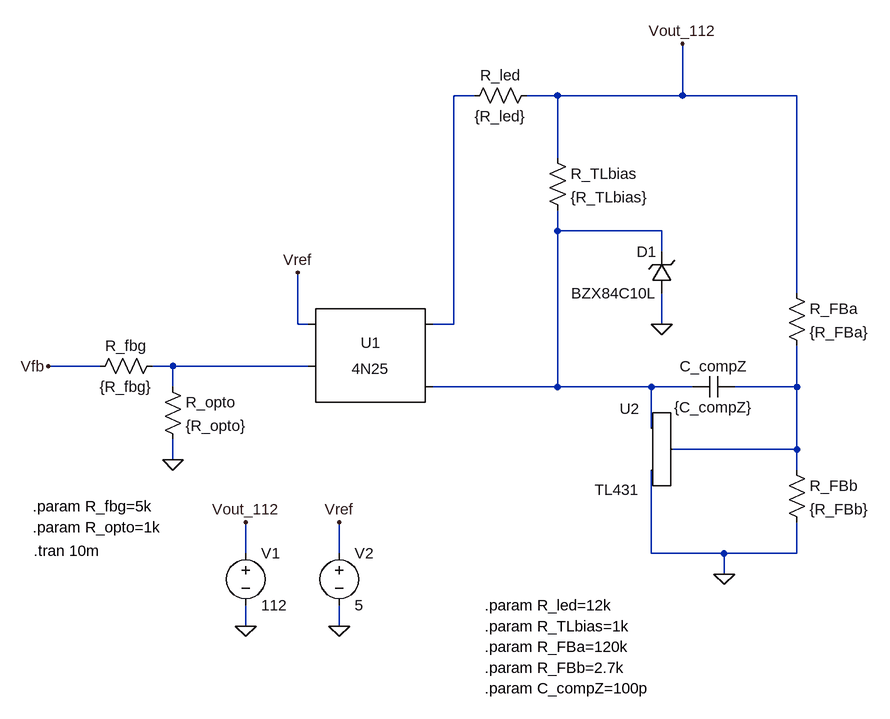
[diagram p0: schematic octocoupler-4N25.asc]
octocoupler-4N25.asc, the LTspice schematic file:
Version 4
SHEET 1 1256 680
WIRE 400 -272 368 -272
WIRE 528 -272 480 -272
WIRE 720 -272 720 -352
WIRE 720 -272 528 -272
WIRE 896 -272 720 -272
WIRE 528 -176 528 -272
WIRE 528 -64 528 -96
WIRE 688 -64 528 -64
WIRE 688 -32 688 -64
WIRE 896 32 896 -272
WIRE 128 80 128 0
WIRE 144 80 128 80
WIRE 368 80 368 -272
WIRE 368 80 336 80
WIRE 688 80 688 32
WIRE -176 144 -256 144
WIRE -64 144 -96 144
WIRE 144 144 -64 144
WIRE -64 176 -64 144
WIRE 528 176 528 -64
WIRE 528 176 336 176
WIRE 672 176 528 176
WIRE 736 176 672 176
WIRE 896 176 896 112
WIRE 896 176 800 176
WIRE 672 240 672 176
WIRE 896 272 896 176
WIRE 896 272 704 272
WIRE -64 288 -64 256
WIRE 896 304 896 272
WIRE 48 432 48 384
WIRE 192 432 192 384
WIRE 672 432 672 304
WIRE 784 432 672 432
WIRE 896 432 896 384
WIRE 896 432 784 432
WIRE 784 464 784 432
WIRE 48 544 48 512
WIRE 192 544 192 512
FLAG 128 0 Vref
FLAG -64 288 0
FLAG -256 144 Vfb
FLAG 784 464 0
FLAG 48 544 0
FLAG 48 384 Vout_112
FLAG 720 -352 Vout_112
FLAG 192 544 0
FLAG 192 384 Vref
FLAG 688 80 0
SYMBOL Optos\\4N25 240 144 M0
SYMATTR InstName U1
SYMBOL res -80 160 R0
SYMATTR InstName R_opto
SYMATTR Value {R_opto}
SYMBOL res -80 128 R90
WINDOW 0 0 56 VBottom 2
WINDOW 3 32 56 VTop 2
SYMATTR InstName R_fbg
SYMATTR Value {R_fbg}
SYMBOL ZZZ\\REF\\TL431 688 240 M0
SYMATTR InstName U2
SYMBOL cap 800 160 R90
WINDOW 0 0 32 VBottom 2
WINDOW 3 32 32 VTop 2
SYMATTR InstName C_compZ
SYMATTR Value {C_compZ}
SYMBOL res 880 16 R0
SYMATTR InstName R_FBa
SYMATTR Value {R_FBa}
SYMBOL res 880 288 R0
SYMATTR InstName R_FBb
SYMATTR Value {R_FBb}
SYMBOL res 512 -192 R0
SYMATTR InstName R_TLbias
SYMATTR Value {R_TLbias}
SYMBOL res 496 -288 R90
WINDOW 0 0 56 VBottom 2
WINDOW 3 32 56 VTop 2
SYMATTR InstName R_led
SYMATTR Value {R_led}
SYMBOL zener 704 32 R180
WINDOW 0 24 64 Left 2
WINDOW 3 24 0 Left 2
SYMATTR InstName D1
SYMATTR Value BZX84C10L
SYMBOL voltage 48 416 R0
WINDOW 123 0 0 Left 0
WINDOW 39 0 0 Left 0
SYMATTR InstName V1
SYMATTR Value 112
SYMBOL voltage 192 416 R0
WINDOW 123 0 0 Left 0
WINDOW 39 0 0 Left 0
SYMATTR InstName V2
SYMATTR Value 5
TEXT 416 512 Left 2 !.param R_led=12k
TEXT 416 544 Left 2 !.param R_TLbias=1k
TEXT 416 576 Left 2 !.param R_FBa=120k
TEXT 416 608 Left 2 !.param R_FBb=2.7k
TEXT 416 640 Left 2 !.param C_compZ=100p
TEXT -280 360 Left 2 !.param R_fbg=5k
TEXT -280 392 Left 2 !.param R_opto=1k
TEXT -278 428 Left 2 !.tran 10m

The netlist it stands for:
* octocoupler-4N25.asc
XU1 N001 N002 Vref N003 NC_01 4N25
R_opto N003 0 {R_opto}
R_fbg N003 Vfb {R_fbg}
XU2 N004 0 N002 TL431
C_compZ N004 N002 {C_compZ}
R_FBa Vout_112 N004 {R_FBa}
R_FBb N004 0 {R_FBb}
R_TLbias Vout_112 N002 {R_TLbias}
R_led Vout_112 N001 {R_led}
D1 0 N002 BZX84C10L
V1 Vout_112 0 112
V2 Vref 0 5
.model D D
.lib standard.dio
.param R_led=12k
.param R_TLbias=1k
.param R_FBa=120k
.param R_FBb=2.7k
.param C_compZ=100p
.param R_fbg=5k
.param R_opto=1k
.tran 10m
.lib 4N25.sub
.lib TL431.mod
.backanno
.end